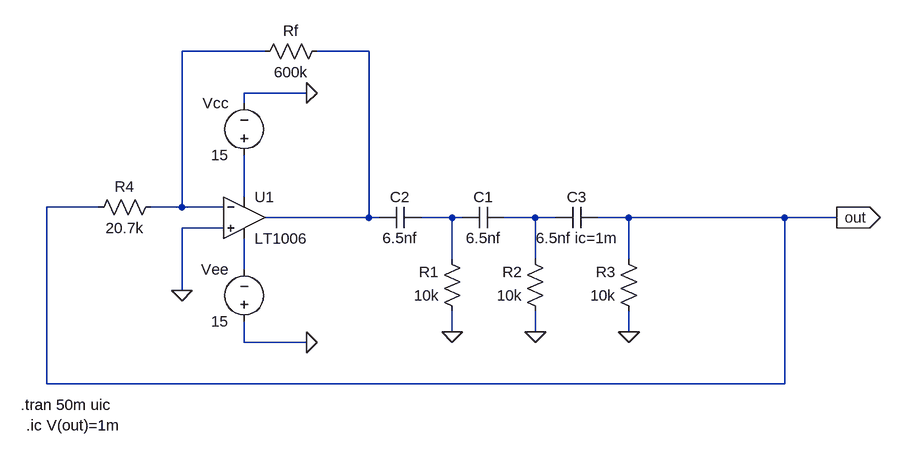
[diagram p0: schematic Day2_OP_AMP_RC_PHASE_SHIFT_OSICLLATOR.asc]
Day2_OP_AMP_RC_PHASE_SHIFT_OSICLLATOR.asc, the LTspice schematic file:
Version 4.1
SHEET 1 1632 680
WIRE 288 0 160 0
WIRE 448 0 368 0
WIRE 352 64 256 64
WIRE 256 80 256 64
WIRE 256 224 256 160
WIRE 32 240 -48 240
WIRE 160 240 160 0
WIRE 160 240 112 240
WIRE 224 240 160 240
WIRE 448 256 448 0
WIRE 448 256 288 256
WIRE 464 256 448 256
WIRE 576 256 528 256
WIRE 592 256 576 256
WIRE 704 256 656 256
WIRE 736 256 704 256
WIRE 848 256 800 256
WIRE 1088 256 848 256
WIRE 1168 256 1088 256
WIRE 224 272 160 272
WIRE 576 320 576 256
WIRE 704 320 704 256
WIRE 848 320 848 256
WIRE 256 336 256 288
WIRE 160 368 160 272
WIRE 576 432 576 400
WIRE 704 432 704 400
WIRE 848 432 848 400
WIRE 256 448 256 416
WIRE 352 448 256 448
WIRE -48 512 -48 240
WIRE 1088 512 1088 256
WIRE 1088 512 -48 512
FLAG 1168 256 out
IOPIN 1168 256 Out
FLAG 576 432 0
FLAG 704 432 0
FLAG 848 432 0
FLAG 352 64 0
FLAG 352 448 0
FLAG 160 368 0
SYMBOL res 384 -16 R90
WINDOW 0 0 56 VBottom 2
WINDOW 3 32 56 VTop 2
SYMATTR InstName Rf
SYMATTR Value 600k
SYMBOL OpAmps\\LT1006 256 192 R0
SYMATTR InstName U1
SYMBOL res 592 416 R180
WINDOW 0 36 76 Left 2
WINDOW 3 36 40 Left 2
SYMATTR InstName R1
SYMATTR Value 10k
SYMBOL cap 464 272 R270
WINDOW 0 32 32 VTop 2
WINDOW 3 0 32 VBottom 2
SYMATTR InstName C2
SYMATTR Value 6.5nf
SYMBOL res 720 416 R180
WINDOW 0 36 76 Left 2
WINDOW 3 36 40 Left 2
SYMATTR InstName R2
SYMATTR Value 10k
SYMBOL cap 592 272 R270
WINDOW 0 32 32 VTop 2
WINDOW 3 0 32 VBottom 2
SYMATTR InstName C1
SYMATTR Value 6.5nf
SYMBOL res 864 416 R180
WINDOW 0 36 76 Left 2
WINDOW 3 36 40 Left 2
SYMATTR InstName R3
SYMATTR Value 10k
SYMBOL cap 736 272 R270
WINDOW 0 32 32 VTop 2
WINDOW 3 0 32 VBottom 2
SYMATTR InstName C3
SYMATTR Value 6.5nf ic=1m
SYMBOL voltage 256 176 R180
WINDOW 0 24 96 Left 2
WINDOW 3 24 16 Left 2
WINDOW 123 0 0 Left 0
WINDOW 39 0 0 Left 0
SYMATTR InstName Vcc
SYMATTR Value 15
SYMBOL voltage 256 432 R180
WINDOW 0 24 96 Left 2
WINDOW 3 24 16 Left 2
WINDOW 123 0 0 Left 0
WINDOW 39 0 0 Left 0
SYMATTR InstName Vee
SYMATTR Value 15
SYMBOL res 128 224 R90
WINDOW 0 0 56 VBottom 2
WINDOW 3 32 56 VTop 2
SYMATTR InstName R4
SYMATTR Value 20.7k
TEXT -88 544 Left 2 !.tran 50m uic
TEXT -80 576 Left 2 !.ic V(out)=1m

The netlist it stands for:
* Day2_OP_AMP_RC_PHASE_SHIFT_OSICLLATOR.asc
Rf N002 N001 600k
X§U1 0 N001 N003 N006 N002 LT1006  ; pins In+ In- V+ V- OUT
R1 0 N004 10k
C2 N002 N004 6.5nf
R2 0 N005 10k
C1 N004 N005 6.5nf
R3 0 out 10k
C3 N005 out 6.5nf ic=1m
Vcc N003 0 15
Vee 0 N006 15
R4 N001 out 20.7k
.tran 50m uic
.ic V(out)=1m
.lib LTC.lib
.backanno
.end